# Altium schematic sheet main.SchDoc
size 209 x 148 mm
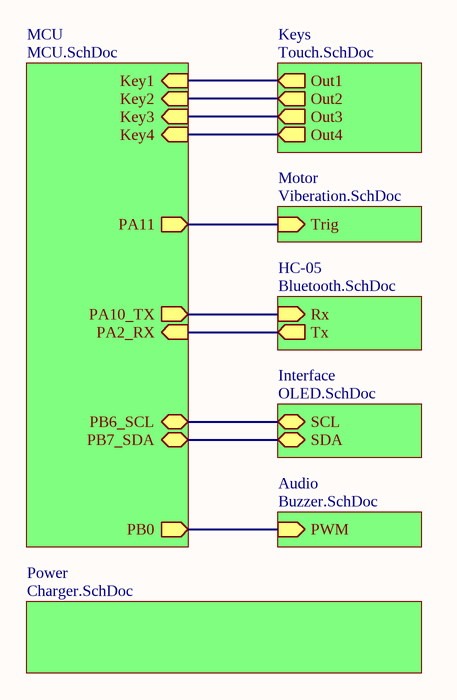
[diagram p0: main.SchDoc]

## Sub-sheets
Audio = Buzzer.SchDoc: PWM (in)
HC-05 = Bluetooth.SchDoc: Rx (in), Tx (out)
Interface = OLED.SchDoc: SCL (bidir), SDA (bidir)
Keys = Touch.SchDoc: Out4 (out), Out2 (out), Out1 (out), Out3 (out)
MCU = MCU.SchDoc: PA10_TX (out), PA2_RX (in), PB7_SDA (bidir), PB6_SCL (bidir), Key1 (in), Key2 (in), Key3 (in), Key4 (in), PB0 (out), PA11 (out)
Motor = Viberation.SchDoc: Trig (in)
Power = Charger.SchDoc: no entries

## Nets
(unnamed): sheet MCU/PA10_TX, sheet HC-05/Rx
(unnamed): sheet MCU/PA2_RX, sheet HC-05/Tx
(unnamed): sheet MCU/PB7_SDA, sheet Interface/SDA
(unnamed): sheet MCU/PB6_SCL, sheet Interface/SCL
(unnamed): sheet MCU/Key1, sheet Keys/Out1
(unnamed): sheet MCU/Key2, sheet Keys/Out2
(unnamed): sheet MCU/Key3, sheet Keys/Out3
(unnamed): sheet MCU/Key4, sheet Keys/Out4
(unnamed): sheet MCU/PB0, sheet Audio/PWM
(unnamed): sheet MCU/PA11, sheet Motor/Trig